# EAGLE schematic Buck Converter Board (EAGLE 9.1.3)
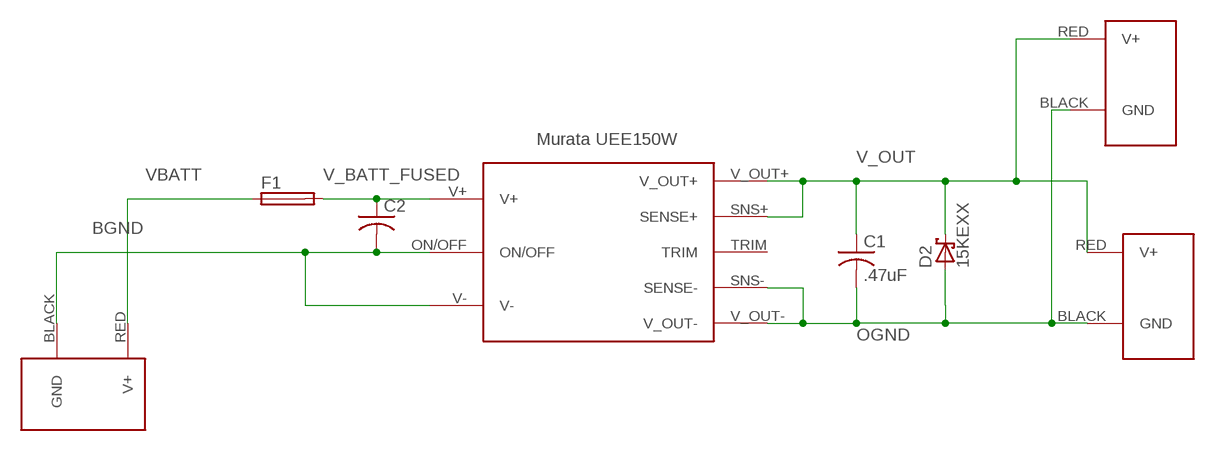
[diagram p0: schematic, sheet 1]

## Parts
C1  .47uF  C-USC0805  [C0805]
C2  C-USC0805  [C0805]
D2  15KEXX  [CB429-17]
F1  FUSEBLANK_5X20MM  [FUSE_HOLDER_5X20MM]
J1  POWERPOLE_POWER25A_HORIZONTAL_G2  [POWERPOLE_PAIR_25A_HORIZ_G2]
J2  POWERPOLE_POWER25A_HORIZONTAL_G2  [POWERPOLE_PAIR_25A_HORIZ_G2]
J3  POWERPOLE_POWER25A_HORIZONTAL_G2  [POWERPOLE_PAIR_25A_HORIZ_G2]
UEE150W  UEE150W  [DOSA1/8]

## Nets
BGND: C2.2 J1.BLACK(GND) UEE150W.ON/OFF UEE150W.V-
OGND: C1.2 D2.A J2.BLACK(GND) J3.BLACK(GND) UEE150W.SNS-(SENSE-) UEE150W.V_OUT-
V_BATT_FUSED: C2.1 F1.2 UEE150W.V+
V_OUT: C1.1 D2.C J2.RED(V+) J3.RED(V+) UEE150W.SNS+(SENSE+) UEE150W.V_OUT+
VBATT: F1.1 J1.RED(V+)
Unconnected: UEE150W.TRIM

## Library data of the parts
C1 C2 = rcl:C-US: CAPACITOR, American symbol; SPICEPREFIX: C
D2 = diode:15KEXX: DIODE
F1 = fuse:FUSE: Fuse; OC_FARNELL: unknown; OC_NEWARK: unknown
J1-J3 = powerpoles:POWERPOLE_POWER: Anderson Powerpole Power Connector using ameteur radio standard layout
UEE150W = REV Aux Circuit:UEE150W